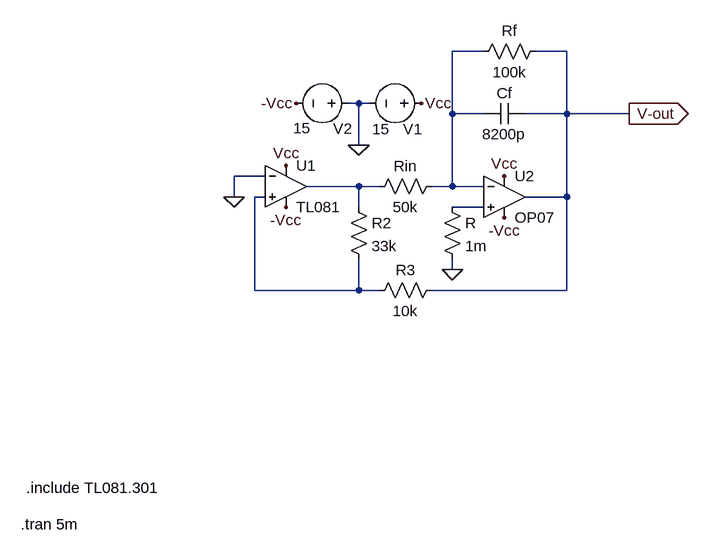
[diagram p0: schematic IntegratorOP07.asc]
IntegratorOP07.asc, the LTspice schematic file:
Version 4
SHEET 1 880 680
WIRE 208 -128 160 -128
WIRE 336 -128 288 -128
WIRE 16 -48 0 -48
WIRE 32 -48 16 -48
WIRE 160 -32 160 -128
WIRE 208 -32 160 -32
WIRE 336 -32 336 -128
WIRE 336 -32 272 -32
WIRE 432 -32 336 -32
WIRE 16 16 16 -48
WIRE -128 64 -176 64
WIRE 16 80 -64 80
WIRE 48 80 16 80
WIRE 160 80 160 -32
WIRE 160 80 128 80
WIRE 208 80 160 80
WIRE -176 96 -176 64
WIRE -128 96 -144 96
WIRE 336 96 336 -32
WIRE 336 96 272 96
WIRE 16 112 16 80
WIRE 208 112 160 112
WIRE 160 208 160 192
WIRE -144 240 -144 96
WIRE 16 240 16 192
WIRE 16 240 -144 240
WIRE 48 240 16 240
WIRE 336 240 336 96
WIRE 336 240 128 240
FLAG 160 208 0
FLAG 240 64 Vcc
FLAG 240 128 -Vcc
FLAG 16 16 0
FLAG 112 -48 Vcc
FLAG -80 -48 -Vcc
FLAG -176 96 0
FLAG -96 48 Vcc
FLAG -96 112 -Vcc
FLAG 432 -32 V-out
IOPIN 432 -32 Out
SYMBOL Opamps\\OP07 240 32 R0
SYMATTR InstName U2
SYMBOL cap 272 -48 R90
WINDOW 0 0 32 VBottom 2
WINDOW 3 32 32 VTop 2
SYMATTR InstName Cf
SYMATTR Value 8200p
SYMBOL res 144 64 R90
WINDOW 0 0 56 VBottom 2
WINDOW 3 32 56 VTop 2
SYMATTR InstName Rin
SYMATTR Value 50k
SYMBOL res 304 -144 R90
WINDOW 0 0 56 VBottom 2
WINDOW 3 32 56 VTop 2
SYMATTR InstName Rf
SYMATTR Value 100k
SYMBOL res 144 96 R0
SYMATTR InstName R
SYMATTR Value 1m
SYMBOL voltage 128 -48 R90
WINDOW 0 40 14 VRight 2
WINDOW 3 40 64 VRight 2
WINDOW 123 0 0 Left 0
WINDOW 39 0 0 Left 0
SYMATTR InstName V1
SYMATTR Value 15
SYMBOL voltage 16 -48 R90
WINDOW 0 39 10 VRight 2
WINDOW 3 38 74 VRight 2
WINDOW 123 0 0 Left 0
WINDOW 39 0 0 Left 0
SYMATTR InstName V2
SYMATTR Value 15
SYMBOL res 0 96 R0
SYMATTR InstName R2
SYMATTR Value 33k
SYMBOL res 144 224 R90
WINDOW 0 0 56 VBottom 2
WINDOW 3 32 56 VTop 2
SYMATTR InstName R3
SYMATTR Value 10k
SYMBOL OpAmps\\opamp2 -96 16 R0
SYMATTR InstName U1
SYMATTR Value TL081
TEXT -504 600 Left 2 !.tran 5m
TEXT -496 544 Left 2 !.include TL081.301

The netlist it stands for:
* IntegratorOP07.asc
XU2 N004 N001 Vcc -Vcc V-out LT1001  ; OP07, pins In+ In- V+ V- OUT
Cf V-out N001 8200p
Rin N001 N002 50k
Rf V-out N001 100k
R N004 0 1m
V1 Vcc 0 15
V2 0 -Vcc 15
R2 N002 N003 33k
R3 V-out N003 10k
XU1 N003 0 Vcc -Vcc N002 TL081  ; pins In+ In- V+ V- OUT
.tran 5m
.include TL081.301
.lib LTC.lib
.backanno
.end